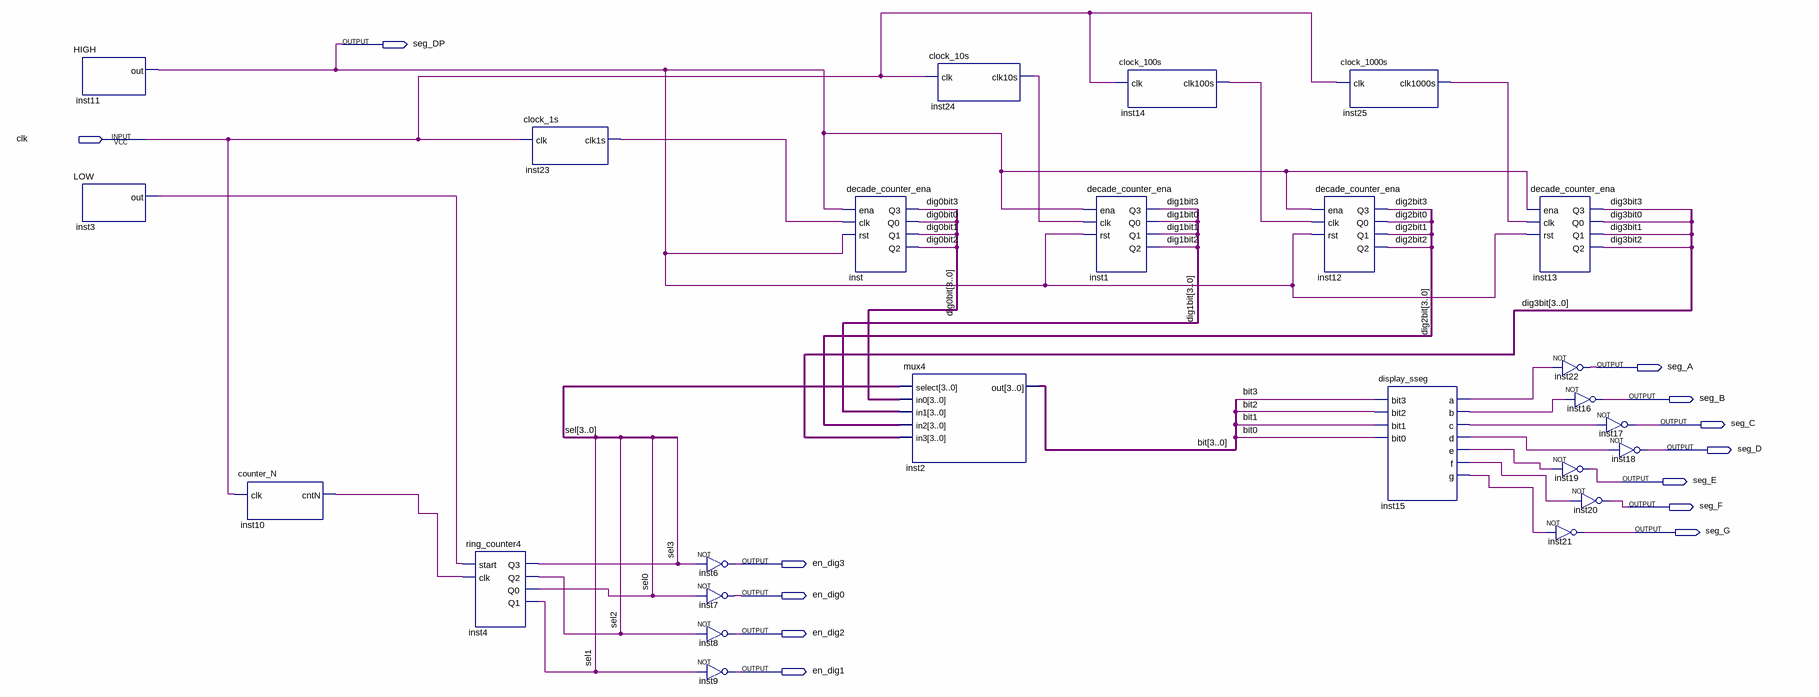
[diagram p0: schematic sheet]
// Quartus schematic test_4dig.bdf as structural Verilog: 25 symbols, 13 pins
module test_4dig (
  input  clk,
  output seg_DP,
  output seg_A,
  output seg_B,
  output seg_C,
  output seg_D,
  output seg_E,
  output seg_F,
  output seg_G,
  output en_dig3,
  output en_dig0,
  output en_dig2,
  output en_dig1
);

  wire inst3_out, inst10_cntn, inst14_clk100s, inst15_a, inst15_b, inst15_c, inst15_d, inst15_e, inst15_f,
       inst15_g, inst23_clk1s, inst24_clk10s, inst25_clk1000s;
  wire [3:0] \bit , dig0bit, dig1bit, dig2bit, dig3bit, sel;

  HIGH inst11 (.out(seg_DP));
  LOW inst3 (.out(inst3_out));
  counter_N inst10 (.clk(clk), .cntN(inst10_cntn));
  ring_counter4 inst4 (.start(inst3_out), .clk(inst10_cntn), .Q3(sel[3]), .Q2(sel[2]), .Q0(sel[0]), .Q1(sel[1]));
  clock_1s inst23 (.clk(clk), .clk1s(inst23_clk1s));
  not inst6 (en_dig3, sel[3]);
  not inst7 (en_dig0, sel[0]);
  not inst8 (en_dig2, sel[2]);
  not inst9 (en_dig1, sel[1]);
  decade_counter_ena inst (
    .ena(seg_DP), .clk(inst23_clk1s), .rst(seg_DP), .Q3(dig0bit[3]), .Q0(dig0bit[0]), .Q1(dig0bit[1]),
    .Q2(dig0bit[2]));
  mux4 inst2 (.select(sel), .in0(dig0bit), .in1(dig1bit), .in2(dig2bit), .in3(dig3bit), .out(\bit ));
  clock_10s inst24 (.clk(clk), .clk10s(inst24_clk10s));
  clock_100s inst14 (.clk(clk), .clk100s(inst14_clk100s));
  decade_counter_ena inst1 (
    .ena(seg_DP), .clk(inst24_clk10s), .rst(seg_DP), .Q3(dig1bit[3]), .Q0(dig1bit[0]), .Q1(dig1bit[1]),
    .Q2(dig1bit[2]));
  decade_counter_ena inst12 (
    .ena(seg_DP), .clk(inst14_clk100s), .rst(seg_DP), .Q3(dig2bit[3]), .Q0(dig2bit[0]), .Q1(dig2bit[1]),
    .Q2(dig2bit[2]));
  clock_1000s inst25 (.clk(clk), .clk1000s(inst25_clk1000s));
  display_sseg inst15 (
    .bit3(\bit [3]), .bit2(\bit [2]), .bit1(\bit [1]), .bit0(\bit [0]), .a(inst15_a), .b(inst15_b),
    .c(inst15_c), .d(inst15_d), .e(inst15_e), .f(inst15_f), .g(inst15_g));
  decade_counter_ena inst13 (
    .ena(seg_DP), .clk(inst25_clk1000s), .rst(seg_DP), .Q3(dig3bit[3]), .Q0(dig3bit[0]), .Q1(dig3bit[1]),
    .Q2(dig3bit[2]));
  not inst22 (seg_A, inst15_a);
  not inst16 (seg_B, inst15_b);
  not inst19 (seg_E, inst15_e);
  not inst20 (seg_F, inst15_f);
  not inst21 (seg_G, inst15_g);
  not inst17 (seg_C, inst15_c);
  not inst18 (seg_D, inst15_d);
endmodule
